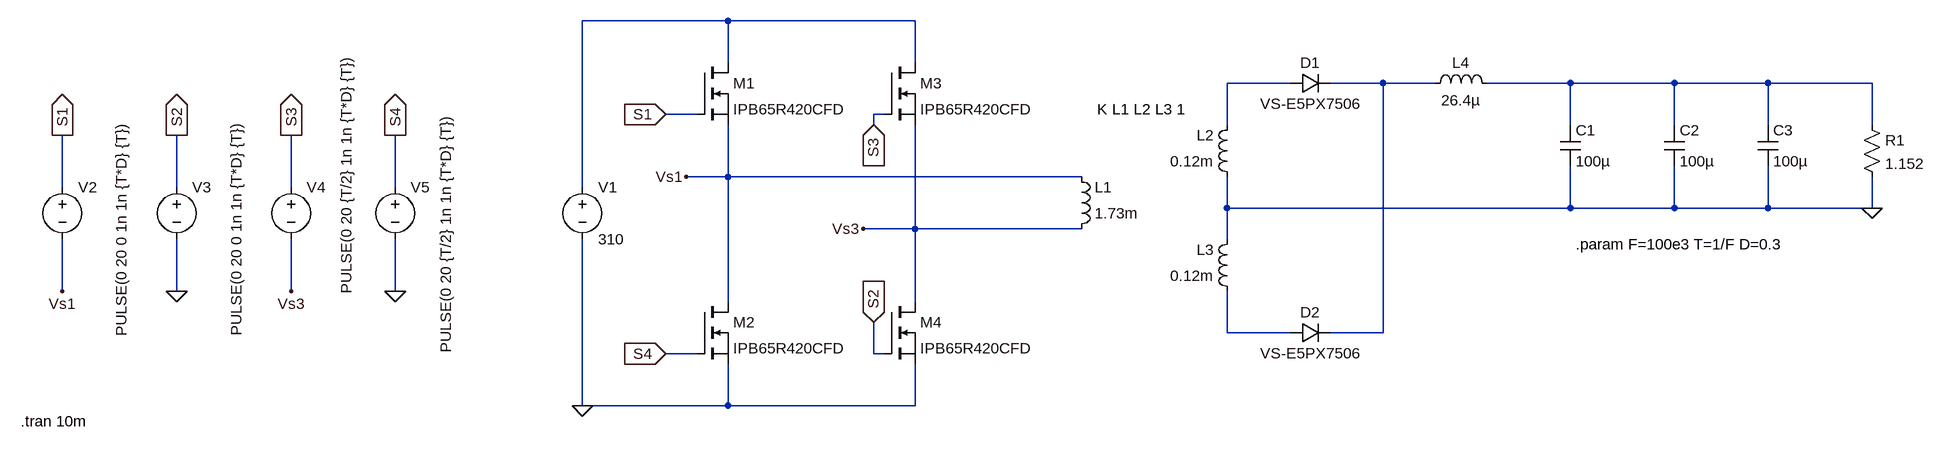
[diagram p0: schematic Draft1.asc]
Draft1.asc, the LTspice schematic file:
Version 4.1
SHEET 1 2192 680
WIRE 336 -464 112 -464
WIRE 624 -464 336 -464
WIRE 336 -400 336 -464
WIRE 624 -400 624 -464
WIRE 1200 -368 1104 -368
WIRE 1344 -368 1264 -368
WIRE 1424 -368 1344 -368
WIRE 1632 -368 1504 -368
WIRE 1792 -368 1632 -368
WIRE 1936 -368 1792 -368
WIRE 2096 -368 1936 -368
WIRE 288 -320 240 -320
WIRE 576 -320 560 -320
WIRE 560 -304 560 -320
WIRE 1104 -304 1104 -368
WIRE 1632 -304 1632 -368
WIRE 1792 -304 1792 -368
WIRE 1936 -304 1936 -368
WIRE 2096 -304 2096 -368
WIRE 336 -224 336 -304
WIRE 336 -224 272 -224
WIRE 880 -224 336 -224
WIRE -688 -208 -688 -288
WIRE -512 -208 -512 -288
WIRE -336 -208 -336 -288
WIRE -176 -208 -176 -288
WIRE 112 -208 112 -464
WIRE 1104 -176 1104 -224
WIRE 1632 -176 1632 -240
WIRE 1632 -176 1104 -176
WIRE 1792 -176 1792 -240
WIRE 1792 -176 1632 -176
WIRE 1936 -176 1936 -240
WIRE 1936 -176 1792 -176
WIRE 2096 -176 2096 -224
WIRE 2096 -176 1936 -176
WIRE 624 -144 624 -304
WIRE 624 -144 544 -144
WIRE 880 -144 624 -144
WIRE 1104 -128 1104 -176
WIRE -688 -48 -688 -128
WIRE -512 -48 -512 -128
WIRE -336 -48 -336 -128
WIRE -176 -48 -176 -128
WIRE 336 -32 336 -224
WIRE 624 -32 624 -144
WIRE 1104 16 1104 -48
WIRE 1200 16 1104 16
WIRE 1344 16 1344 -368
WIRE 1344 16 1264 16
WIRE 288 48 240 48
WIRE 560 48 560 0
WIRE 576 48 560 48
WIRE 112 128 112 -128
WIRE 336 128 336 64
WIRE 336 128 112 128
WIRE 624 128 624 64
WIRE 624 128 336 128
FLAG 112 128 0
FLAG 240 -320 S1
IOPIN 240 -320 In
FLAG 560 0 S2
IOPIN 560 0 In
FLAG 560 -304 S3
IOPIN 560 -304 In
FLAG 240 48 S4
IOPIN 240 48 In
FLAG 2096 -176 0
FLAG 272 -224 Vs1
FLAG 544 -144 Vs3
FLAG -688 -48 Vs1
FLAG -336 -48 Vs3
FLAG -512 -48 0
FLAG -176 -48 0
FLAG -688 -288 S1
IOPIN -688 -288 Out
FLAG -512 -288 S2
IOPIN -512 -288 Out
FLAG -336 -288 S3
IOPIN -336 -288 Out
FLAG -176 -288 S4
IOPIN -176 -288 Out
SYMBOL voltage 112 -224 R0
WINDOW 123 0 0 Left 0
WINDOW 39 0 0 Left 0
SYMATTR InstName V1
SYMATTR Value 310
SYMBOL nmos 288 -400 R0
SYMATTR InstName M1
SYMATTR Value IPB65R420CFD
SYMBOL nmos 288 -32 R0
SYMATTR InstName M2
SYMATTR Value IPB65R420CFD
SYMBOL nmos 576 -400 R0
SYMATTR InstName M3
SYMATTR Value IPB65R420CFD
SYMBOL nmos 576 -32 R0
SYMATTR InstName M4
SYMATTR Value IPB65R420CFD
SYMBOL ind 864 -128 M180
WINDOW 0 36 80 Left 2
WINDOW 3 36 40 Left 2
SYMATTR InstName L1
SYMATTR Value 1.73m
SYMATTR Type ind
SYMBOL ind 1120 -208 R180
WINDOW 0 36 80 Left 2
WINDOW 3 36 40 Left 2
SYMATTR InstName L2
SYMATTR Value 0.12m
SYMATTR Type ind
SYMBOL ind 1120 -32 R180
WINDOW 0 36 80 Left 2
WINDOW 3 36 40 Left 2
SYMATTR InstName L3
SYMATTR Value 0.12m
SYMATTR Type ind
SYMBOL diode 1200 -352 R270
WINDOW 0 32 32 VTop 2
WINDOW 3 0 32 VBottom 2
SYMATTR InstName D1
SYMATTR Value VS-E5PX7506
SYMBOL diode 1200 32 R270
WINDOW 0 32 32 VTop 2
WINDOW 3 0 32 VBottom 2
SYMATTR InstName D2
SYMATTR Value VS-E5PX7506
SYMBOL ind 1408 -352 R270
WINDOW 0 32 56 VTop 2
WINDOW 3 5 56 VBottom 2
SYMATTR InstName L4
SYMATTR Value 26.4µ
SYMBOL cap 1616 -304 R0
SYMATTR InstName C1
SYMATTR Value 100µ
SYMBOL res 2080 -320 R0
SYMATTR InstName R1
SYMATTR Value 1.152
SYMBOL cap 1776 -304 R0
SYMATTR InstName C2
SYMATTR Value 100µ
SYMBOL cap 1920 -304 R0
SYMATTR InstName C3
SYMATTR Value 100µ
SYMBOL voltage -688 -224 R0
WINDOW 3 91 246 VLeft 2
WINDOW 123 0 0 Left 0
WINDOW 39 0 0 Left 0
SYMATTR InstName V2
SYMATTR Value PULSE(0 20 0 1n 1n {T*D} {T})
SYMBOL voltage -512 -224 R0
WINDOW 3 92 245 VLeft 2
WINDOW 123 0 0 Left 0
WINDOW 39 0 0 Left 0
SYMATTR InstName V3
SYMATTR Value PULSE(0 20 0 1n 1n {T*D} {T})
SYMBOL voltage -336 -224 R0
WINDOW 3 85 -190 VRight 2
WINDOW 123 0 0 Left 0
WINDOW 39 0 0 Left 0
SYMATTR InstName V4
SYMATTR Value PULSE(0 20 {T/2} 1n 1n {T*D} {T})
SYMBOL voltage -176 -224 R0
WINDOW 3 78 271 VLeft 2
WINDOW 123 0 0 Left 0
WINDOW 39 0 0 Left 0
SYMATTR InstName V5
SYMATTR Value PULSE(0 20 {T/2} 1n 1n {T*D} {T})
TEXT 904 -328 Left 2 !K L1 L2 L3 1
TEXT 1640 -120 Left 2 !.param F=100e3 T=1/F D=0.3
TEXT -752 152 Left 2 !.tran 10m

The netlist it stands for:
* Draft1.asc
V1 N001 0 310
M1 N001 S1 Vs1 Vs1 IPB65R420CFD
M2 Vs1 S4 0 0 IPB65R420CFD
M3 N001 S3 Vs3 Vs3 IPB65R420CFD
M4 Vs3 S2 0 0 IPB65R420CFD
L1 Vs3 Vs1 1.73m
L2 0 N002 0.12m
L3 N005 0 0.12m
D1 N002 N003 VS-E5PX7506
D2 N005 N003 VS-E5PX7506
L4 N003 N004 26.4µ
C1 N004 0 100µ
R1 N004 0 1.152
C2 N004 0 100µ
C3 N004 0 100µ
V2 S1 Vs1 PULSE(0 20 0 1n 1n {T*D} {T})
V3 S2 0 PULSE(0 20 0 1n 1n {T*D} {T})
V4 S3 Vs3 PULSE(0 20 {T/2} 1n 1n {T*D} {T})
V5 S4 0 PULSE(0 20 {T/2} 1n 1n {T*D} {T})
.model D D
.lib standard.dio
.model NMOS NMOS
.model PMOS PMOS
.lib standard.mos
K L1 L2 L3 1
.param F=100e3 T=1/F D=0.3
.tran 10m
.backanno
.end